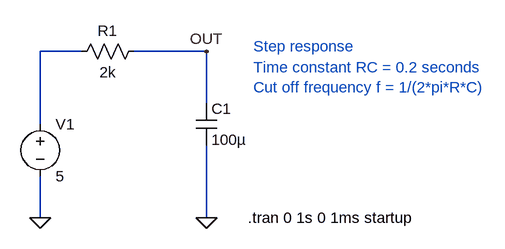
[diagram p0: schematic RC-lowpass-step-response.asc]
RC-lowpass-step-response.asc, the LTspice schematic file:
Version 4.1
SHEET 1 880 680
WIRE 128 64 64 64
WIRE 320 64 208 64
WIRE 320 144 320 64
WIRE 64 176 64 64
WIRE 64 320 64 256
WIRE 320 320 320 208
FLAG 64 320 0
FLAG 320 320 0
FLAG 320 64 OUT
SYMBOL cap 304 144 R0
SYMATTR InstName C1
SYMATTR Value 100µ
SYMBOL res 224 48 R90
WINDOW 0 0 56 VBottom 2
WINDOW 3 32 56 VTop 2
SYMATTR InstName R1
SYMATTR Value 2k
SYMBOL voltage 64 160 R0
WINDOW 123 0 0 Left 2
WINDOW 39 0 0 Left 2
SYMATTR InstName V1
SYMATTR Value 5
TEXT 384 320 Left 2 !.tran 0 1s 0 1ms startup
TEXT 392 88 Left 2 ;Time constant RC = 0.2 seconds\nCut off frequency f = 1/(2*pi*R*C)
TEXT 392 56 Left 2 ;Step response

The netlist it stands for:
* RC-lowpass-step-response.asc
C1 OUT 0 100µ
R1 OUT N001 2k
V1 N001 0 5
.tran 0 1s 0 1ms startup
* Time constant RC = 0.2 seconds
* Cut off frequency f = 1/(2*pi*R*C)
* Step response
.backanno
.end